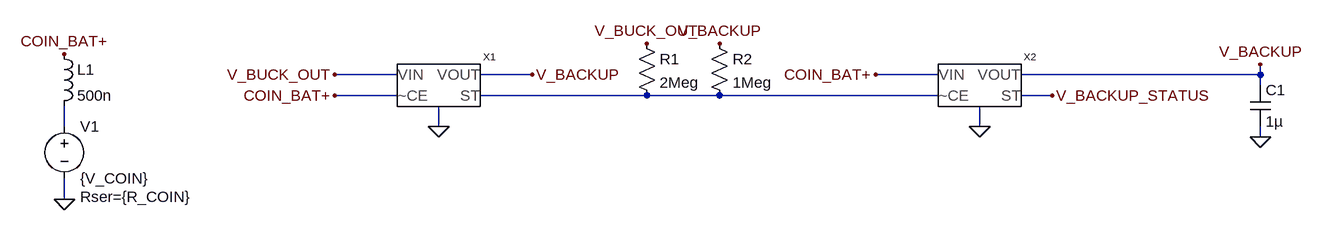
[diagram p0: schematic backup.asc]
backup.asc, the LTspice schematic file:
Version 4.1
SHEET 1 1416 680
WIRE 48 352 -48 352
WIRE 256 352 176 352
WIRE 880 352 784 352
WIRE 1376 352 1376 336
WIRE 1376 352 1008 352
WIRE 1376 368 1376 352
WIRE 48 384 -48 384
WIRE 432 384 176 384
WIRE 544 384 432 384
WIRE 880 384 544 384
WIRE 1056 384 1008 384
WIRE -464 432 -464 400
WIRE 112 432 112 400
WIRE 944 432 944 400
WIRE 1376 448 1376 432
WIRE -464 544 -464 512
FLAG -464 544 0
FLAG -464 320 COIN_BAT+
FLAG -48 384 COIN_BAT+
FLAG -48 352 V_BUCK_OUT
FLAG 256 352 V_BACKUP
FLAG 112 432 0
FLAG 944 432 0
FLAG 784 352 COIN_BAT+
FLAG 544 304 V_BACKUP
FLAG 432 304 V_BUCK_OUT
FLAG 1056 384 V_BACKUP_STATUS
FLAG 1376 448 0
FLAG 1376 336 V_BACKUP
SYMBOL voltage -464 416 R0
WINDOW 123 0 0 Left 0
WINDOW 39 24 124 Left 2
SYMATTR SpiceLine Rser={R_COIN}
SYMATTR InstName V1
SYMATTR Value {V_COIN}
SYMBOL ind -480 304 R0
SYMATTR InstName L1
SYMATTR Value 500n
SYMATTR SpiceLine Rser=1m
SYMBOL LM66100 96 368 R0
SYMATTR InstName X1
SYMBOL LM66100 928 368 R0
SYMATTR InstName X2
SYMBOL res 416 288 R0
SYMATTR InstName R1
SYMATTR Value 2Meg
SYMBOL res 528 288 R0
SYMATTR InstName R2
SYMATTR Value 1Meg
SYMBOL cap 1360 368 R0
SYMATTR InstName C1
SYMATTR Value 1µ

The netlist it stands for:
* backup.asc
V1 N002 0 {V_COIN} Rser={R_COIN}
L1 COIN_BAT+ N002 500n Rser=1m
X§X1 V_BUCK_OUT V_BACKUP COIN_BAT+ N001 0 LM66100  ; pins VIN VOUT CE ST G
X§X2 COIN_BAT+ V_BACKUP N001 V_BACKUP_STATUS 0 LM66100  ; pins VIN VOUT CE ST G
R1 V_BUCK_OUT N001 2Meg
R2 V_BACKUP N001 1Meg
C1 V_BACKUP 0 1µ
.backanno
.end